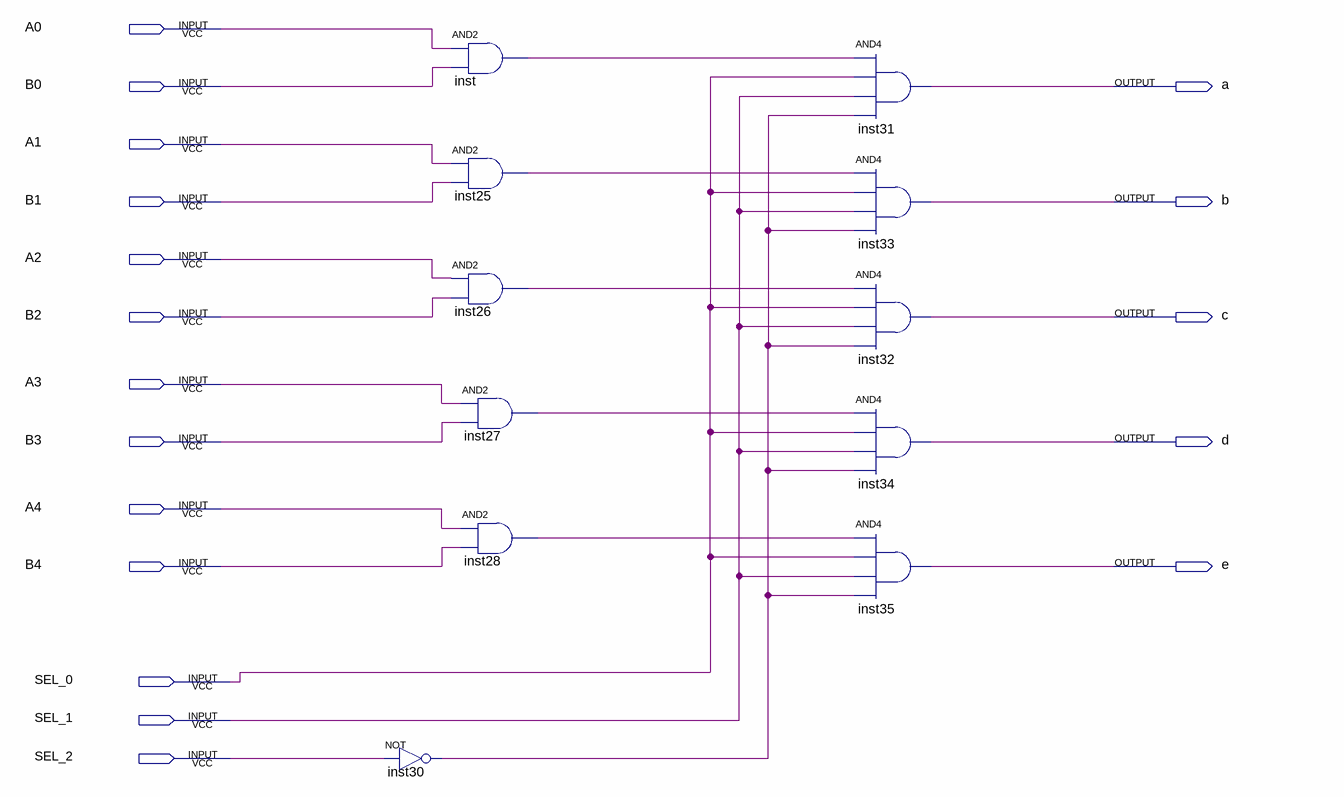
[diagram p0: schematic sheet]
// Quartus schematic Block1.bdf as structural Verilog: 11 symbols, 18 pins
module Block1 (
  input  A0,
  input  B0,
  input  A1,
  input  B1,
  input  A2,
  input  B2,
  input  A3,
  input  B3,
  input  A4,
  input  B4,
  input  SEL_0,
  input  SEL_1,
  input  SEL_2,
  output a,
  output b,
  output c,
  output d,
  output e
);

  wire inst25_out, inst26_out, inst27_out, inst28_out, inst30_out, inst_out;

  and inst (inst_out, A0, B0);
  and inst25 (inst25_out, A1, B1);
  and inst26 (inst26_out, A2, B2);
  not inst30 (inst30_out, SEL_2);
  and inst27 (inst27_out, A3, B3);
  and inst28 (inst28_out, A4, B4);
  and inst31 (a, inst_out, SEL_0, SEL_1, inst30_out);
  and inst33 (b, inst25_out, SEL_0, SEL_1, inst30_out);
  and inst32 (c, inst26_out, SEL_0, SEL_1, inst30_out);
  and inst34 (d, inst27_out, SEL_0, SEL_1, inst30_out);
  and inst35 (e, inst28_out, SEL_0, SEL_1, inst30_out);
endmodule
